# Altium schematic sheet Sheet4.SchDoc
size A4
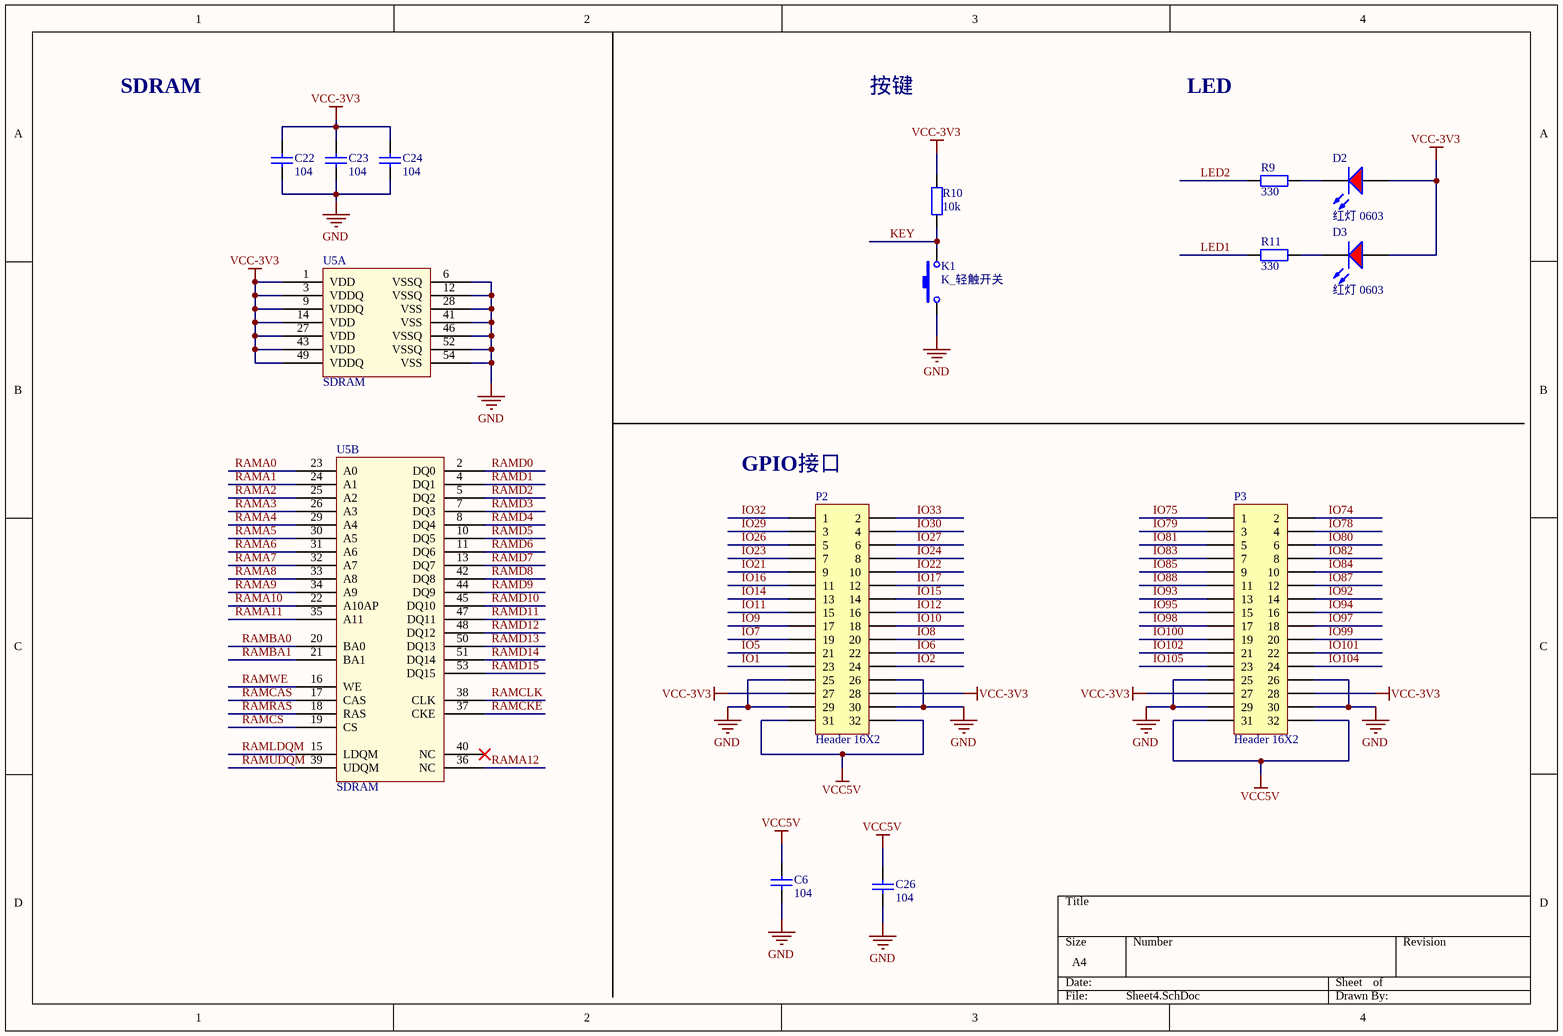
[diagram p0: Sheet4.SchDoc]

## Parts
C6  104  [0603_C]
C22  104  [0603_C]
C23  104  [0603_C]
C24  104  [0603_C]
C26  104  [0603_C]
D2  红灯 0603  [0603_LED_S1]
D3  红灯 0603  [0603_LED_S1]
K1  K_轻触开关  [KEY]
P2  Header 16X2  [HDR2X16]
P3  Header 16X2  [HDR2X16]
R9  330  [0603_R]
R10  10k  [0603_R]
R11  330  [0603_R]
U5  SDRAM  [SDRAM]  (parts A,B of 2)

## Nets
GND: C6.1 C22.1 C23.1 C24.1 C26.1 K1.1 P2.25 P2.26 P2.29 P2.30 P3.25 P3.26 P3.29 P3.30 U5.6(VSSQ) U5.12(VSSQ) U5.28(VSS) U5.41(VSS) U5.46(VSSQ) U5.52(VSSQ) U5.54(VSS)
VCC5V: C6.2 C26.2 P2.31 P2.32 P3.31 P3.32
VCC-3V3: C22.2 C23.2 C24.2 D2.A D3.A P2.27 P2.28 P3.27 P3.28 R10.1 U5.1(VDD) U5.3(VDDQ) U5.9(VDDQ) U5.14(VDD) U5.27(VDD) U5.43(VDD) U5.49(VDDQ)
IO1: P2.23
IO2: P2.24
IO5: P2.21
IO6: P2.22
IO7: P2.19
IO8: P2.20
IO9: P2.17
IO10: P2.18
IO11: P2.15
IO12: P2.16
IO14: P2.13
IO15: P2.14
IO16: P2.11
IO17: P2.12
IO21: P2.9
IO22: P2.10
IO23: P2.7
IO24: P2.8
IO26: P2.5
IO27: P2.6
IO29: P2.3
IO30: P2.4
IO32: P2.1
IO33: P2.2
IO74: P3.2
IO75: P3.1
IO78: P3.4
IO79: P3.3
IO80: P3.6
IO81: P3.5
IO82: P3.8
IO83: P3.7
IO84: P3.10
IO85: P3.9
IO87: P3.12
IO88: P3.11
IO92: P3.14
IO93: P3.13
IO94: P3.16
IO95: P3.15
IO97: P3.18
IO98: P3.17
IO99: P3.20
IO100: P3.19
IO101: P3.22
IO102: P3.21
IO104: P3.24
IO105: P3.23
KEY: K1.2 R10.2
LED1: R11.2
LED2: R9.2
RAMA0: U5.23(A0)
RAMA1: U5.24(A1)
RAMA2: U5.25(A2)
RAMA3: U5.26(A3)
RAMA4: U5.29(A4)
RAMA5: U5.30(A5)
RAMA6: U5.31(A6)
RAMA7: U5.32(A7)
RAMA8: U5.33(A8)
RAMA9: U5.34(A9)
RAMA10: U5.22(A10AP)
RAMA11: U5.35(A11)
RAMA12: U5.36(NC)
RAMBA0: U5.20(BA0)
RAMBA1: U5.21(BA1)
RAMCAS: U5.17(CAS)
RAMCKE: U5.37(CKE)
RAMCLK: U5.38(CLK)
RAMCS: U5.19(CS)
RAMD0: U5.2(DQ0)
RAMD1: U5.4(DQ1)
RAMD2: U5.5(DQ2)
RAMD3: U5.7(DQ3)
RAMD4: U5.8(DQ4)
RAMD5: U5.10(DQ5)
RAMD6: U5.11(DQ6)
RAMD7: U5.13(DQ7)
RAMD8: U5.42(DQ8)
RAMD9: U5.44(DQ9)
RAMD10: U5.45(DQ10)
RAMD11: U5.47(DQ11)
RAMD12: U5.48(DQ12)
RAMD13: U5.50(DQ13)
RAMD14: U5.51(DQ14)
RAMD15: U5.53(DQ15)
RAMLDQM: U5.15(LDQM)
RAMRAS: U5.18(RAS)
RAMUDQM: U5.39(UDQM)
RAMWE: U5.16(WE)
NetD2_K: D2.K R9.1
NetD3_K: D3.K R11.1

Not connected (* = marked no-connect by the designer): U5 40(NC)*

## Notes on the sheet
- SDRAM
- 按键
- LED
- (near P2) GPIO接口

## Library data of the parts
C6 C22-C24 C26 = 0603 30pF (300) 5% 50V: 贴片电容; ComponentLink1Description: 供应商链接; ComponentLink1URL: http://www.szlcsc.com/product/details_23122.html; Package: 0603; Supplier: LC; SuppliersPartNumber: C22397
D2 D3 = 0603 红灯: 发光二极管; ComponentLink1Description: 供应商链接; ComponentLink1URL: http://www.szlcsc.com/product/details_2659.html; Package: 0603; Supplier: LC; SuppliersPartNumber: C2286
P2 P3 = Header 16X2: Header, 16-Pin, Dual row; LatestRevisionDate: 17-Jul-2002; LatestRevisionNote: Re-released for DXP Platform.; Publisher: Altium Limited
R9-R11 = 0603 9.1KΩ (9101) 1%: 贴片电阻; ComponentLink1Description: 供应商链接; ComponentLink1URL: http://www.szlcsc.com/product/details_23987.html; Package: 0603; Supplier: LC; SuppliersPartNumber: C23260